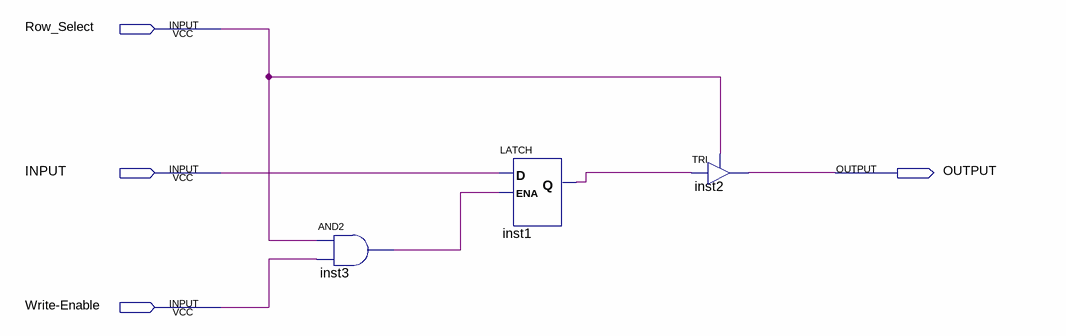
[diagram p0: schematic sheet]
// Quartus schematic RamCell.bdf as structural Verilog: 3 symbols, 4 pins
module RamCell (
  input  Row_Select,
  input  INPUT,
  input  \Write-Enable ,
  output OUTPUT
);

  wire inst1_q, inst3_out;

  and inst3 (inst3_out, Row_Select, \Write-Enable );
  LATCH inst1 (.D(INPUT), .ENA(inst3_out), .Q(inst1_q));
  TRI inst2 (.IN(inst1_q), .OE(Row_Select), .OUT(OUTPUT));
endmodule
